# Altium schematic sheet 243-436_ESP32.SchDoc: Contrôleur
size Letter; ApprovedBy: APPROUVÉ PAR; Engineer: K.Cotton; Organization: Cegep Limoilou; Address1: 1300, 8e Avenue; Address2: Québec, QC; Address3: Canada; Address4: G1J 5L5; SheetNumber: 2; SheetTotal: 4
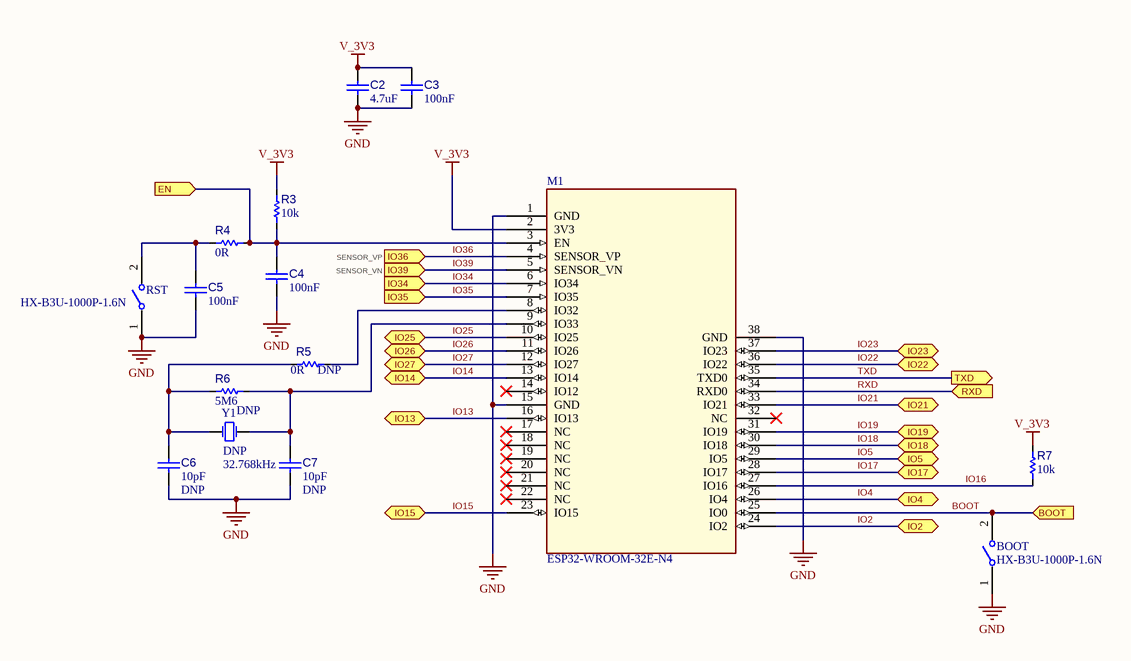
[diagram p0: 243-436_ESP32.SchDoc]

## Parts
BOOT  HX-B3U-1000P-1.6N  [S_B3U-1000P]
C2  value 4.7uF  [C_1005[0402]]  (hidden comment: CAP CER 4.7uF 6.3V X5R 0402)
C3  value 100nF  [C_1005[0402]]  (hidden comment: CAP CER 100nF 50V 0402)
C4  value 100nF  [C_1005[0402]]  (hidden comment: DNP)  (no BOM)
C5  value 100nF  [C_1005[0402]]  (hidden comment: CAP CER 100nF 50V 0402)
C6  DNP  value 10pF  [C_1005[0402]]  (no BOM)
C7  DNP  value 10pF  [C_1005[0402]]  (no BOM)
M1  ESP32-WROOM-32E-N4  [ESP32­WROOM­32E_EXP-TH]
R3  value 10k  [R_1005[0402]]  (hidden comment: DNP)  (no BOM)
R4  value 0R  [R_1005[0402]]  (hidden comment: Res 0R 0402)
R5  DNP  value 0R  [R_1005[0402]]  (no BOM)
R6  DNP  value 5M6  [R_1005[0402]]  (no BOM)
R7  value 10k  [R_1005[0402]]  (hidden comment: Res 10k 1% 0402)
RST  HX-B3U-1000P-1.6N  [S_B3U-1000P]
Y1  DNP  value 32.768kHz  [Y_2012_2P]  (no BOM)

## Ports
BOOT (in, see 243-436_Manette-ESP32[3C]), EN (in, see 243-436_Manette-ESP32[3C]), IO2 (bidir, see 243-436_Manette-ESP32[2B]), IO4 (bidir, see 243-436_Manette-ESP32[2B]), IO5 (bidir, see 243-436_Manette-ESP32[3B]), IO13 (bidir, see 243-436_Manette-ESP32[2B]), IO14 (bidir, see 243-436_Manette-ESP32[3B]), IO15 (bidir, see 243-436_Manette-ESP32[3B]), IO17 (bidir, see 243-436_Manette-ESP32[2B]), IO18 (bidir, see 243-436_Manette-ESP32[2B]), IO19 (bidir, see 243-436_Manette-ESP32[2B]), IO21 (bidir, see 243-436_Manette-ESP32[3A]), IO22 (bidir, see 243-436_Manette-ESP32[3B]), IO23 (bidir, see 243-436_Manette-ESP32[2B]), IO25 (bidir, see 243-436_Manette-ESP32[2B]), IO26 (bidir, see 243-436_Manette-ESP32[3B]), IO27 (bidir, see 243-436_Manette-ESP32[3B]), IO34 (in, see 243-436_Manette-ESP32[3B]), IO35 (in, see 243-436_Manette-ESP32[3B]), IO36 (in, see 243-436_Manette-ESP32[3B]), IO39 (in, see 243-436_Manette-ESP32[3B]), RXD (in, see 243-436_Manette-ESP32[3B]), TXD (out, see 243-436_Manette-ESP32[3C])

## Nets
GND: BOOT.1 C2.1 C3.1 C4.1 C5.1 C6.1 C7.1 M1.1(GND) M1.15(GND) M1.38(GND) RST.1
V_3V3: C2.2 C3.2 M1.2(3V3) R3.2 R7.2
BOOT: BOOT.2 M1.25(IO0) ; port BOOT
EN: C4.2 M1.3(EN) R3.1 R4.2 ; port EN
IO2: M1.24(IO2) ; port IO2
IO4: M1.26(IO4) ; port IO4
IO5: M1.29(IO5) ; port IO5
IO13: M1.16(IO13) ; port IO13
IO14: M1.13(IO14) ; port IO14
IO15: M1.23(IO15) ; port IO15
IO16: M1.27(IO16) R7.1
IO17: M1.28(IO17) ; port IO17
IO18: M1.30(IO18) ; port IO18
IO19: M1.31(IO19) ; port IO19
IO21: M1.33(IO21) ; port IO21
IO22: M1.36(IO22) ; port IO22
IO23: M1.37(IO23) ; port IO23
IO25: M1.10(IO25) ; port IO25
IO26: M1.11(IO26) ; port IO26
IO27: M1.12(IO27) ; port IO27
IO34: M1.6(IO34) ; port IO34
IO35: M1.7(IO35) ; port IO35
IO36: M1.4(SENSOR_VP) ; port IO36
IO39: M1.5(SENSOR_VN) ; port IO39
RXD: M1.34(RXD0) ; port RXD
TXD: M1.35(TXD0) ; port TXD
NetC5_2: C5.2 R4.1 RST.2
NetC6_2: C6.2 R5.1 R6.1 Y1.1(OSC1)
NetC7_2: C7.2 M1.9(IO33) R6.2 Y1.2(OSC2)
NetM1_8: M1.8(IO32) R5.2

Not connected (* = marked no-connect by the designer): M1 14(IO12)* 17(NC)* 18(NC)* 19(NC)* 20(NC)* 21(NC)* 22(NC)* 32(NC)*

## Notes on the sheet
- SENSOR_VP
- SENSOR_VN
- Titre :
- Conception :
- Date :
- Approbation :
- Heure :
- Révision :
- Feuille
- de
- Fichier :

## Library data of the parts
BOOT RST = SW_B3U-1000P: SWITCH TACTILE SPST-NO 0.05A 12V; Manufacturer 1: hanxia; Mounting Technology: SMT; Supplier 1: LCSC; Supplier Part Number 1: C49234121; Manufacturer 2: Omron; Manufacturer Part Number 1: HX-B3U-1000P-1.6N; Manufacturer Part Number 2: B3U-1000P
C2 = CAP016: Capacitor type 1; Manufacturer 1: Samsung; Manufacturer Part Number 1: CL05A475MQ5NRNC; LibRef: CAP016; Tolerance: 20%; Rated Voltage: 6.3V; Dielectric: X5R; Mounting Technology: SMT; Supplier 1: LCSC; Supplier Part Number 1: C307423
C3 C5 = CAP001: Capacitor type 1; Manufacturer 1: Yageo; Manufacturer Part Number 1: CC0402KRX7R9BB104; LibRef: CAP001; Tolerance: 10%; Dielectric: X7R; Code CEGEP: KCOND01SM; Rated Voltage: 50V; Mounting Technology: SMT; Supplier 1: LCSC; Supplier Part Number 1: C131394
C4 = CAP001: Capacitor type 1; Manufacturer 1: Yageo; Manufacturer Part Number 1: CC0402KRX7R9BB104; LibRef: CAP001; Tolerance: 10%; Rated Voltage: 50V; Dielectric: X7R; Code CEGEP: KCOND01SM; Mounting Technology: SMT; Supplier 1: LCSC; Supplier Part Number 1: C131394
C6 C7 = CAP014: Capacitor type 1; Manufacturer 1: Yageo; Manufacturer Part Number 1: CC0402JRNPO9BN100; LibRef: CAP014; Tolerance: 5%; Rated Voltage: 50V; Dielectric: C0G; Mounting Technology: SMT; Supplier 1: LCSC; Supplier Part Number 1: C106199
M1 = M_ESP32-WROOM-32E-N4-TH: ESP32 Module SMT Castellated; Manufacturer 1: Espressif Systems; Manufacturer Part Number 1: ESP32-WROOM-32E-N4; Mounting Technology: TH; Supplier 1: LCSC; Supplier Part Number 1: C701341
R3 = RES003: Resistor type 1; Manufacturer 1: Yageo; Manufacturer Part Number 1: RC0402FR-0710KL; LibRef: RES003; Tolerance: 1%; Puissance: 1/16W; Max Working Voltage: 50V; Mounting Technology: SMT; Supplier 1: LCSC; Supplier Part Number 1: C60490
R4 R5 = RES005: Resistor type 1; Manufacturer 1: Yageo; Manufacturer Part Number 1: RC0402JR-070RL; LibRef: RES005; Max Working Voltage: 50V; Code CEGEP: RES0SM; Mounting Technology: SMT; Supplier 1: LCSC; Supplier Part Number 1: C60485
R6 = RES017: Resistor type 1; Manufacturer 1: Yageo; Manufacturer Part Number 1: RC0402FR-075M6L; LibRef: RES017; Tolerance: 1%; Puissance: 1/16W; Max Working Voltage: 50V; Mounting Technology: SMT; Supplier 1: LCSC; Supplier Part Number 1: C477755
R7 = RES003: Resistor type 1; Manufacturer 1: Yageo; Manufacturer Part Number 1: RC0402FR-0710KL; LibRef: RES003; Puissance: 1/16W; Max Working Voltage: 50V; Tolerance: 1%; Mounting Technology: SMT; Supplier 1: LCSC; Supplier Part Number 1: C60490
Y1 = Y_NX2012_32K768: Crystal NDK 2.0x1.2mm  32.768 KHz; Manufacturer Part Number 1: NX2012SA 32.768KHz  EXS00A-MU00389; Manufacturer 1: NDK; Manufacturer 2: Epson; Manufacturer Part Number 2: X1A0000610008; Supplier Part Number 1: C96341; Supplier 1: LCSC; Mounting Technology: SMT